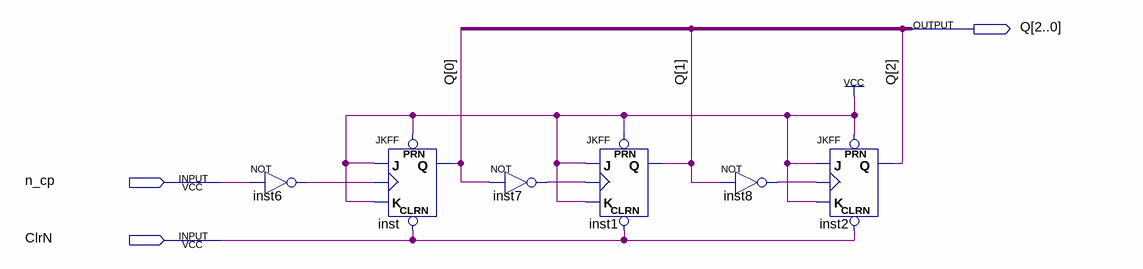
[diagram p0: schematic sheet]
// Quartus schematic ripple_counter.bdf as structural Verilog: 6 symbols, 3 pins
module ripple_counter (
  input  n_cp,
  input  ClrN,
  output [2:0] Q
);

  wire inst6_out, inst7_out, inst8_out;

  not inst6 (inst6_out, n_cp);
  JKFF inst (.PRN(1'b1), .CLRN(ClrN), .K(1'b1), .J(1'b1), .CLK(inst6_out), .Q(Q[0]));
  not inst7 (inst7_out, Q[0]);
  JKFF inst1 (.PRN(1'b1), .CLRN(ClrN), .K(1'b1), .J(1'b1), .CLK(inst7_out), .Q(Q[1]));
  not inst8 (inst8_out, Q[1]);
  JKFF inst2 (.PRN(1'b1), .CLRN(ClrN), .K(1'b1), .J(1'b1), .CLK(inst8_out), .Q(Q[2]));
endmodule
